# EAGLE design voltdivider (EAGLE 4.13)
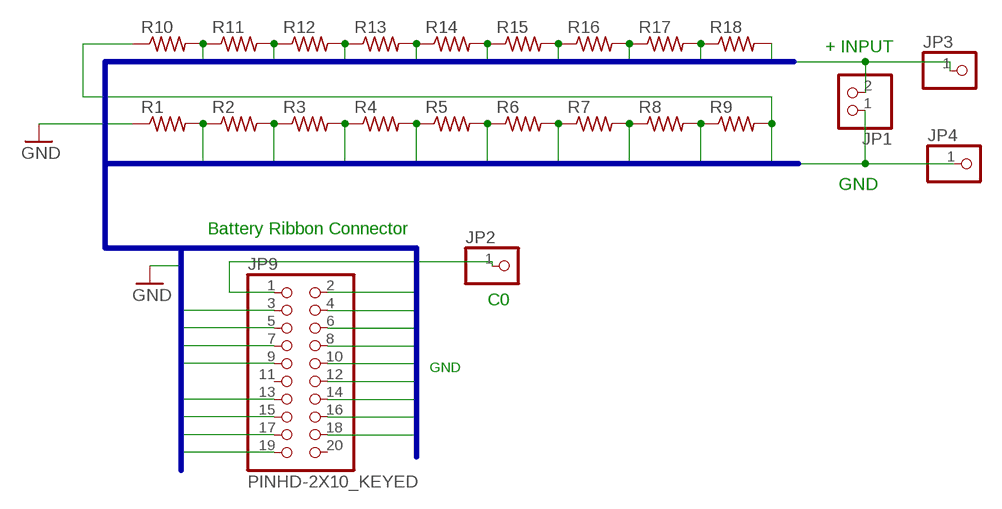
[diagram p0: schematic, sheet 1]

## Parts
JP1  PINHD-1X2  [1X02]
JP2  PINHD-1X1  [1X01]
JP3  PINHD-1X1  [1X01]
JP4  PINHD-1X1  [1X01]
JP9  PINHD-2X10_KEYED  [2X10_KEYED]
R1  R-US_0309/12  [0309/12]
R2  R-US_0309/12  [0309/12]
R3  R-US_0309/12  [0309/12]
R4  R-US_0309/12  [0309/12]
R5  R-US_0309/12  [0309/12]
R6  R-US_0309/12  [0309/12]
R7  R-US_0309/12  [0309/12]
R8  R-US_0309/12  [0309/12]
R9  R-US_0309/12  [0309/12]
R10  R-US_0309/12  [0309/12]
R11  R-US_0309/12  [0309/12]
R12  R-US_0309/12  [0309/12]
R13  R-US_0309/12  [0309/12]
R14  R-US_0309/12  [0309/12]
R15  R-US_0309/12  [0309/12]
R16  R-US_0309/12  [0309/12]
R17  R-US_0309/12  [0309/12]
R18  R-US_0309/12  [0309/12]

## Nets
CH1: JP9.12 R1.2 R2.1
CH2: JP9.3 R2.2 R3.1
CH3: JP9.13 R3.2 R4.1
CH4: JP9.4 R4.2 R5.1
CH5: JP9.14 R5.2 R6.1
CH6: JP9.5 R6.2 R7.1
CH7: JP9.15 R7.2 R8.1
CH8: JP9.6 R8.2 R9.1
CH9: JP9.16 R9.2 R10.1
CH10: JP9.7 R10.2 R11.1
CH11: JP9.17 R11.2 R12.1
CH12: JP9.8 R12.2 R13.1
CH13: JP9.18 R13.2 R14.1
CH14: JP9.9 R14.2 R15.1
CH15: JP9.19 R15.2 R16.1
CH16: JP9.10 R16.2 R17.1
CH17: R17.2 R18.1
CH18: JP1.2 JP3.1 R18.2
GND: JP1.1 JP4.1 JP9.2 R1.1
N$3: JP2.1 JP9.1
Unconnected: JP9.11 JP9.20

## Buses
HDR$:GND,CH[0..18]

## Notes on the sheet
- + INPUT
- GND
- Battery Ribbon Connector
- C0
- GND

## Library data of the parts
JP1 = pinhead:PINHD-1X2: PIN HEADER
JP2-JP4 = pinhead:PINHD-1X1: PIN HEADER
JP9 = pinhead:PINHD-2X10_KEYED
R1-R18 = rcl:R-US_: RESISTOR, American symbol

## Board
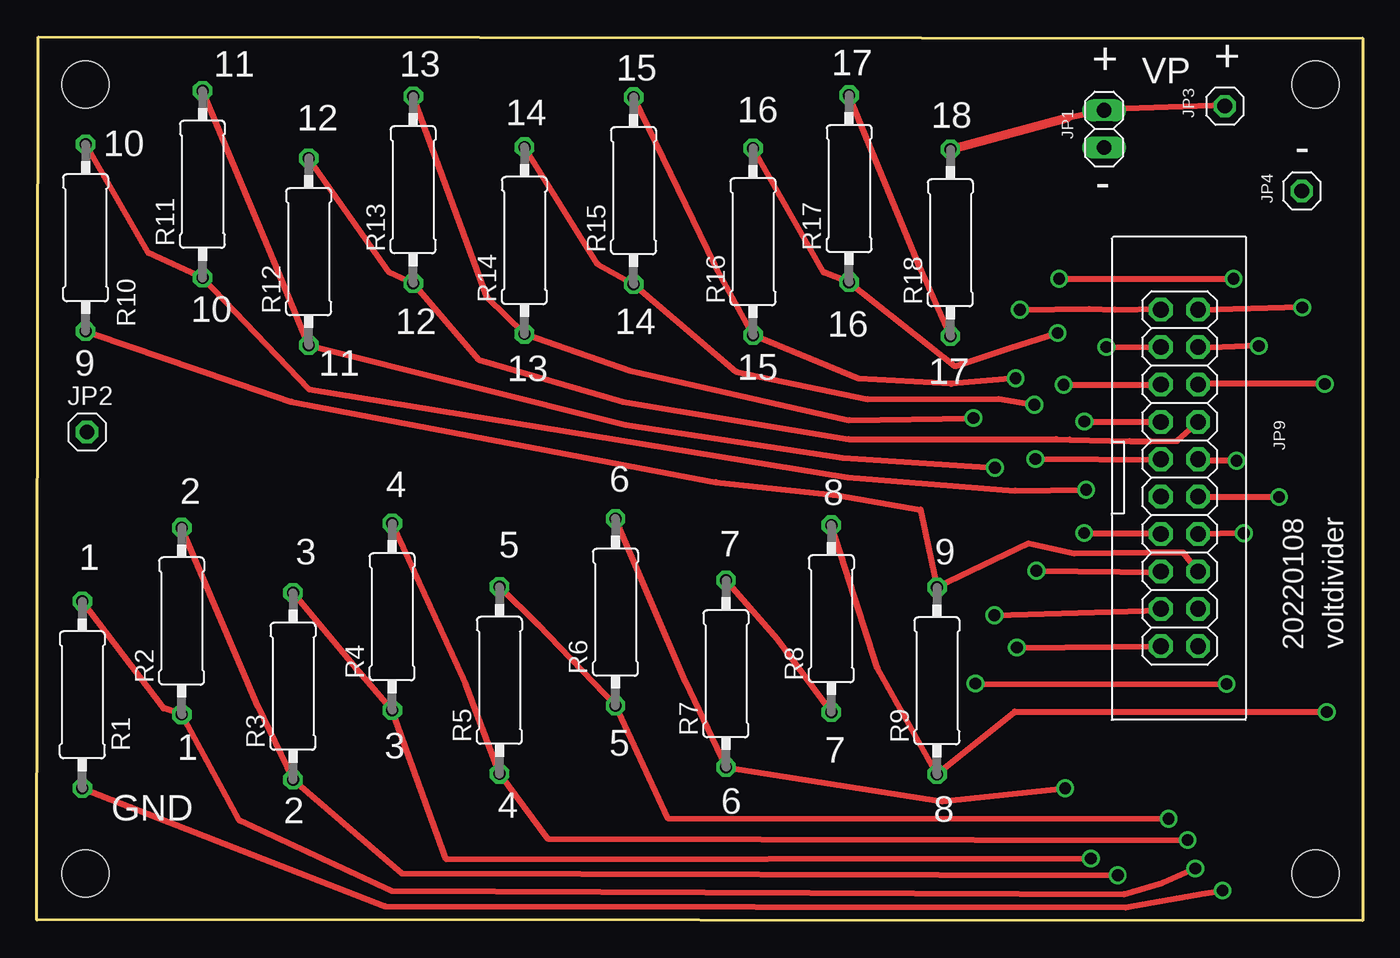
[diagram p1: board, top side]
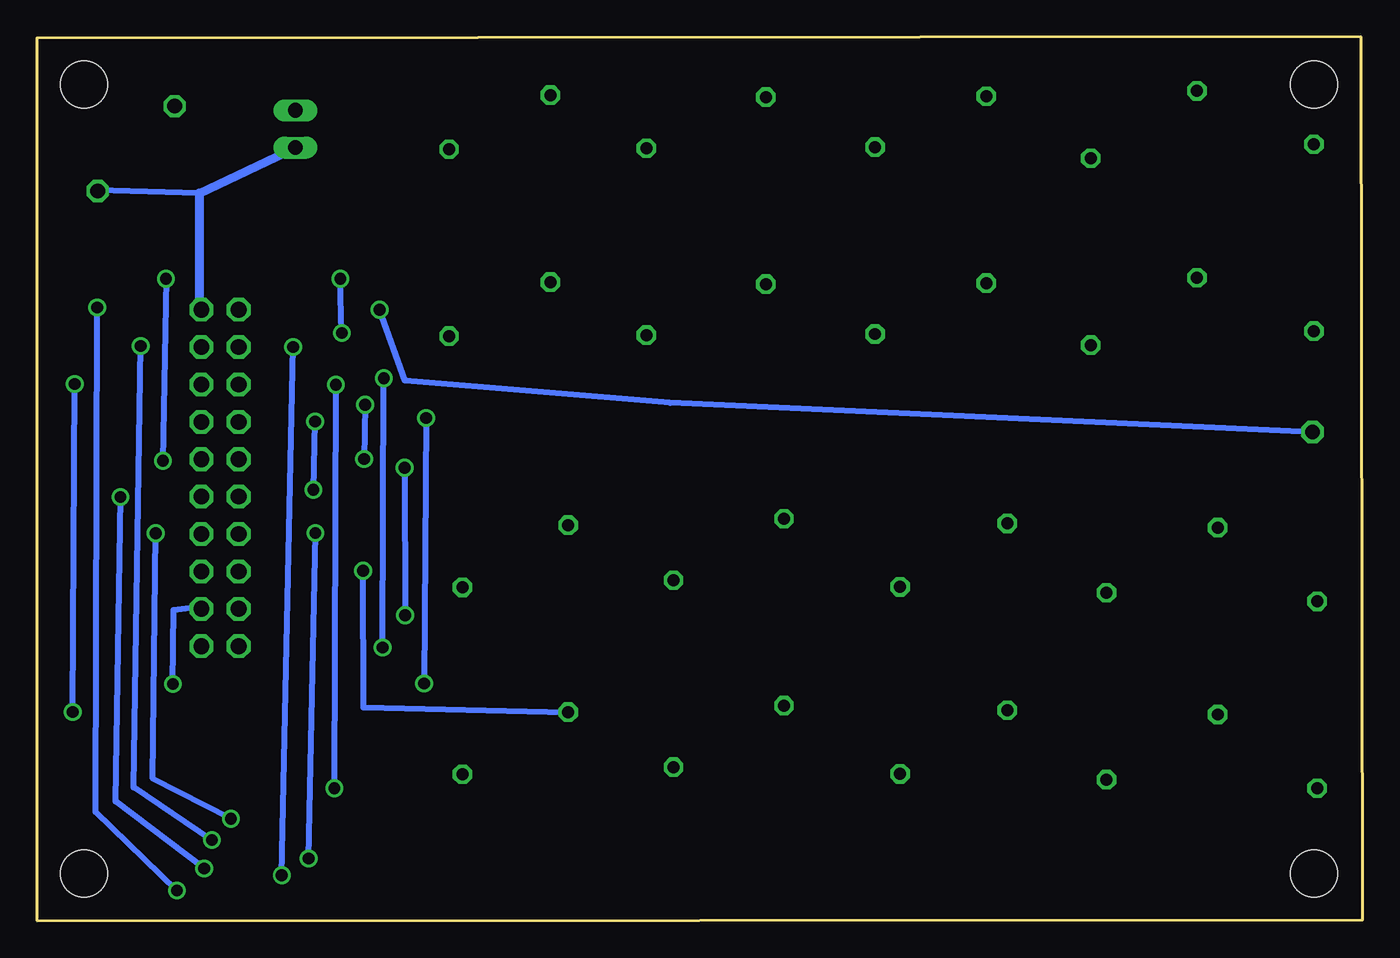
[diagram p2: board, bottom side, seen from below]

Size 90.11 x 60.05 mm. Coordinates in mm from the lower left corner, seen from the top.
Outline: 0,0.05 0.1,60.05 90.11,59.96 90.1,0 0,0.05
Copper layers (1*16): Top 0.035mm / dielectric 1.5mm / Bottom 0.035mm
Design rules "default": minimum track width 8mil, minimum drill 0.6mm, track to track 8mil, track to pad 8mil, pad to pad 8mil, via to via 8mil, smd to smd 0mil, copper to edge 8mil, drill to drill 8mil, minimum pad ring 10mil, minimum via ring 8mil, stop-mask expansion 4mil, vias tented up to drill 0mil, thermal gap 10mil
Holes 3.2 mm at 3.31,3.22 3.31,56.82 86.91,3.22 86.91,56.82

### Footprints (pad centres in the part's own frame; a part is rotated, then mirrored left to right if it is on the bottom)
1X02 = drill 1 long: 1 -1.27,0; 2 1.27,0
1X01 = drill 1 octagon: 1 0,0
2X10_KEYED = drill 1.067 octagon: 1 -11.46,-1.27; 2 -11.46,1.27; 3 -8.92,-1.27; 4 -8.92,1.27; 5 -6.38,-1.27; 6 -6.38,1.27; 7 -3.84,-1.27; 8 -3.84,1.27; 9 -1.3,-1.27; 10 -1.3,1.27; 11 1.24,-1.27; 12 1.24,1.27; 13 3.78,-1.27; 14 3.78,1.27; 15 6.32,-1.27; 16 6.32,1.27; 17 8.86,-1.27; 18 8.86,1.27; 19 11.4,-1.27; 20 11.4,1.27
0309/12 = drill 0.813 octagon: 1 -6.35,0; 2 6.35,0

### Placement (x,y rotation side)
JP1  72.53,53.79 90 top
JP2  3.41,33.2 0 top
JP3  80.74,55.34 0 top
JP4  85.97,49.58 0 top
JP9  77.66,30.05 270 top
R1  3.1,15.35 90 top
R2  9.85,20.36 90 top
R3  17.41,15.93 90 top
R4  24.15,20.65 90 top
R5  31.44,16.33 90 top
R6  39.33,20.96 90 top
R7  46.84,16.78 90 top
R8  54,20.52 90 top
R9  61.18,16.3 90 top
R10  3.32,46.4 90 top
R11  11.26,50.03 90 top
R12  18.48,45.45 90 top
R13  25.58,49.66 90 top
R14  33.14,46.21 90 top
R15  40.56,49.6 90 top
R16  48.68,46.13 90 top
R17  55.21,49.74 90 top
R18  62.09,46.06 90 top

### Tracks (layer width: path | path; a pad name or v marks a point on that pad's centre or on a via)
CH1  (via drill 0.8)
  Top 0.406: v78.73,3.55 76.53,2.58 73.88,1.8 24.07,2.05 13.77,6.81 R2.1 8.61,14.43 R1.2 | JP9.12 78.88,28.78 v84.42,28.78
  Bottom 0.406: v78.73,3.55 84.75,8.11 v84.42,28.78
CH2  (via drill 0.8)
  Top 0.406: v73.46,3.09 24.81,3.22 R3.1 15.01,14.6 R2.2 | JP9.3 76.43,38.95 v72.68,38.98
  Bottom 0.406: v73.46,3.09 v72.68,38.98
CH3  (via drill 0.8)
  Top 0.406: v71.63,4.23 27.83,4.19 R4.1 21.7,17.14 R3.2 | JP9.13 76.42,26.34 v71.17,26.34
  Bottom 0.406: v71.63,4.23 v71.17,26.34
CH4  (via drill 0.8)
  Top 0.406: v78.21,5.48 34.7,5.58 R5.1 29.13,16.1 R4.2 | JP9.4 78.93,38.9 v83.05,39.05
  Bottom 0.406: v78.21,5.48 83.54,9.06 v83.05,39.05
CH5  (via drill 0.8)
  Top 0.406: v76.91,6.93 42.88,6.97 R6.1 34.08,20.12 R5.2 | JP9.14 78.77,26.24 v82.03,26.33
  Bottom 0.406: v76.91,6.93 82.22,9.65 v82.03,26.33
CH6  (via drill 0.8)
  Top 0.406: v69.88,9 61.52,8.1 R7.1 44.1,16.23 R6.2 | JP9.5 76.52,36.42 v69.78,36.42
  Bottom 0.406: v69.88,9 v69.78,36.42
CH7  (via drill 0.8)
  Top 0.406: JP9.15 76.43,23.69 v67.93,23.77 | R8.1 50.34,19.11 R7.2
  Bottom 0.406: v67.93,23.77 67.91,14.48 54,14.12
  Bottom 0.61: R8.1 54,14.12
CH8  (via drill 0.8)
  Top 0.406: v87.66,14.18 66.47,14.21 R9.1 57.14,17.16 R8.2 | JP9.6 78.94,36.47 v87.53,36.47
  Bottom 0.406: v87.66,14.18 v87.53,36.47
CH9
  Top 0.406: R10.1 17.3,35.26 46.14,29.8 54.43,28.89 60.06,27.93 R9.2 67.41,25.64 70.49,24.96 75.7,25.02 77.89,25.02 JP9.16
CH10  (via drill 0.8)
  Top 0.406: v71.31,29.28 66.48,29.22 55.1,30.12 18.5,36.12 R11.1 7.58,45.37 R10.2 | JP9.7 76.56,33.91 v71.19,33.91
  Bottom 0.406: v71.31,29.28 v71.19,33.91
CH11  (via drill 0.8)
  Top 0.406: v65.11,30.77 54.77,31.44 40.02,33.68 R12.1 16.09,44.87 R11.2 | JP9.17 76.43,21.09 v65.08,20.76
  Bottom 0.406: v65.11,30.77 v65.08,20.76
CH12
  Top 0.406: JP9.8 78.96,33.89 77.51,32.6 75.71,32.58 74.27,32.59 70.19,32.68 69.29,32.72 55.18,32.71 39.84,35.25 30.01,38.12 R13.1 23.93,44.07 R12.2
CH13  (via drill 0.8)
  Top 0.406: v63.66,34.15 55.21,34.01 40.36,37.36 R14.1 30.59,42.34 R13.2 | v63.79,16.11 v80.86,16.08
  Bottom 0.406: v63.66,34.15 v63.79,16.11 | v80.86,16.08 80.82,21.11 78.9,21.36 JP9.18
CH14  (via drill 0.8)
  Top 0.406: v67.8,35.06 65.38,35.46 56.47,35.44 47.53,37.31 R15.1 38.12,44.61 R14.2 | JP9.9 76.47,31.33 v67.87,31.37
  Bottom 0.406: v67.8,35.06 v67.87,31.37
CH15  (via drill 0.8)
  Top 0.406: v66.53,36.86 62.14,36.47 55.85,36.83 R16.1 46.08,44.5 R15.2 | JP9.19 76.41,18.65 v66.61,18.56
  Bottom 0.406: v66.61,18.56 v66.53,36.86
CH16  (via drill 0.8)
  Top 0.406: v69.38,39.93 66.05,38.89 62.39,37.68 R17.1 53.47,44.04 R16.2 | v69.48,43.62 v81.33,43.62 | JP9.10 79.03,31.25 v81.54,31.25
  Bottom 0.406: v69.38,39.93 v69.48,43.62 | v81.33,43.62 v81.54,31.25
CH17
  Top 0.406: R18.1 60.09,44.21 R17.2
CH18
  Top 0.406: 72.94,55.16 JP1.2 | 70.02,54.54 72.94,55.16 | JP3.1 80.89,55.45 72.94,55.16
  Top 0.61: R18.2 70.02,54.54
GND  (via drill 0.8)
  Top 0.406: R1.1 23.67,0.99 73.98,0.91 79.38,1.86 v80.58,2.05 | JP9.2 78.93,41.48 v86,41.66
  Bottom 0.406: v80.58,2.05 86.11,7.4 v86,41.66 | JP9.2 79.05,41.61 | JP4.1 86.1,49.61 79.05,49.43
  Bottom 0.61: JP1.1 79.05,49.43 79.05,41.61
N$3  (via drill 0.8)
  Top 0.406: v66.81,41.51 71.53,41.57 73.26,41.52 76.43,41.57 JP9.1
  Bottom 0.406: JP2.1 47.06,35.18 65.09,36.7 v66.81,41.51

### Text on the board
tNames: + | 11 | 13 | 15 | 17 | + | VP | 12 | 14 | 16 | 18 | 10 | - | - | 10 | 12 | 14 | 16 | 9 | 11 | 13 | 15 | 17 | 4 | 6 | 2 | 8 | 5 | 7 | 1 | 3 | 9 | 20220108 | voltdivider | 1 | 3 | 5 | 7 | GND | 2 | 4 | 6 | 8